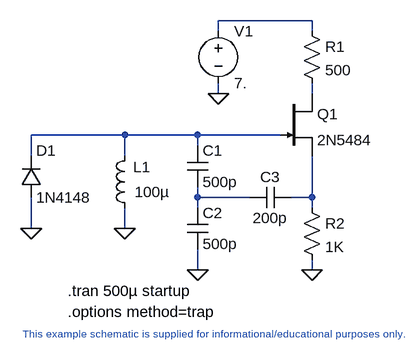
[diagram p0: schematic colpits.asc]
colpits.asc, the LTspice schematic file:
Version 4
SHEET 1 2740 2480
WIRE 2208 1872 2064 1872
WIRE 2064 1888 2064 1872
WIRE 2208 1888 2208 1872
WIRE 2064 1984 2064 1968
WIRE 2208 1984 2208 1968
WIRE 1920 2048 1776 2048
WIRE 2032 2048 1920 2048
WIRE 2160 2048 2032 2048
WIRE 2032 2064 2032 2048
WIRE 1776 2080 1776 2048
WIRE 1920 2080 1920 2048
WIRE 2032 2144 2032 2128
WIRE 2112 2144 2032 2144
WIRE 2208 2144 2208 2080
WIRE 2208 2144 2176 2144
WIRE 2032 2160 2032 2144
WIRE 2208 2160 2208 2144
WIRE 1776 2192 1776 2144
WIRE 1920 2192 1920 2160
WIRE 2032 2256 2032 2224
WIRE 2208 2256 2208 2240
FLAG 1920 2192 0
FLAG 2032 2256 0
FLAG 2208 2256 0
FLAG 2064 1984 0
FLAG 1776 2192 0
SYMBOL NJF 2160 1984 R0
SYMATTR InstName Q1
SYMATTR Value 2N5484
SYMBOL RES 2192 1872 R0
SYMATTR InstName R1
SYMATTR Value 500
SYMBOL res 2192 2144 R0
SYMATTR InstName R2
SYMATTR Value 1K
SYMBOL ind 1936 2176 R180
WINDOW 0 3 79 Right 2
WINDOW 3 1 40 Right 2
SYMATTR InstName L1
SYMATTR Value 100µ
SYMBOL cap 2016 2064 R0
SYMATTR InstName C1
SYMATTR Value 500p
SYMBOL cap 2016 2160 R0
SYMATTR InstName C2
SYMATTR Value 500p
SYMBOL cap 2176 2128 R90
WINDOW 0 0 32 VBottom 2
WINDOW 3 32 32 VTop 2
SYMATTR InstName C3
SYMATTR Value 200p
SYMBOL VOLTAGE 2064 1872 R0
SYMATTR InstName V1
SYMATTR Value 7.
SYMBOL diode 1760 2144 M180
WINDOW 0 24 72 Left 2
WINDOW 3 24 0 Left 2
SYMATTR InstName D1
SYMATTR Value 1N4148
TEXT 1832 2288 Left 2 !.tran 500µ startup
TEXT 1832 2320 Left 2 !.options method=trap
TEXT 2048 2344 Top 1 ;This example schematic is supplied for informational/educational purposes only.

The netlist it stands for:
* colpits.asc
J§Q1 N002 N003 N005 2N5484
R1 N001 N002 500
R2 N005 0 1K
L1 0 N003 100µ
C1 N003 N004 500p
C2 N004 0 500p
C3 N005 N004 200p
V1 N001 0 7.
D1 0 N003 1N4148
.model D D
.lib standard.dio
.model NJF NJF
.model PJF PJF
.lib standard.jft
.tran 500µ startup
.options method=trap
* This example schematic is supplied for informational/educational purposes only.
.backanno
.end